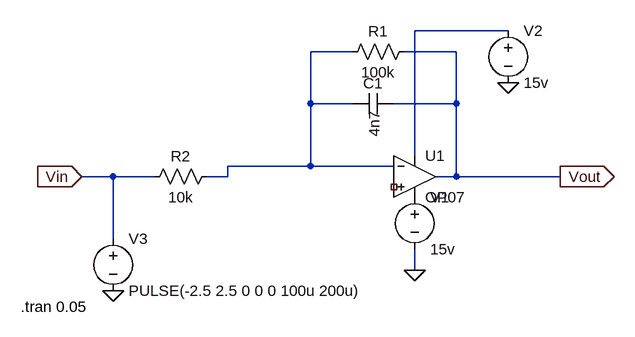
[diagram p0: schematic (7) integrator using op-amp.asc]
(7) integrator using op-amp.asc, the LTspice schematic file:
Version 4
SHEET 1 880 680
WIRE 352 48 208 48
WIRE 112 80 48 80
WIRE 272 80 192 80
WIRE 48 160 48 80
WIRE 112 160 48 160
WIRE 272 160 272 80
WIRE 272 160 176 160
WIRE 208 240 208 48
WIRE 48 256 48 160
WIRE 48 256 -80 256
WIRE 176 256 48 256
WIRE -256 272 -304 272
WIRE -192 272 -256 272
WIRE -80 272 -80 256
WIRE -80 272 -112 272
WIRE 272 272 272 160
WIRE 272 272 240 272
WIRE 432 272 272 272
WIRE -256 368 -256 272
WIRE 208 416 208 384
FLAG -304 272 Vin
IOPIN -304 272 In
FLAG 432 272 Vout
IOPIN 432 272 Out
FLAG 208 416 0
FLAG 352 128 0
FLAG -256 448 0
SYMBOL res 208 64 R90
WINDOW 0 0 56 VBottom 2
WINDOW 3 32 56 VTop 2
SYMATTR InstName R1
SYMATTR Value 100k
SYMBOL res -96 256 R90
WINDOW 0 0 56 VBottom 2
WINDOW 3 32 56 VTop 2
SYMATTR InstName R2
SYMATTR Value 10k
SYMBOL cap 176 144 R90
WINDOW 0 0 32 VBottom 2
WINDOW 3 47 46 Bottom 2
SYMATTR InstName C1
SYMATTR Value 4n7
SYMBOL voltage 208 288 R0
WINDOW 123 0 0 Left 0
WINDOW 39 0 0 Left 0
SYMATTR InstName V1
SYMATTR Value 15v
SYMBOL voltage 352 32 R0
WINDOW 123 0 0 Left 0
WINDOW 39 0 0 Left 0
SYMATTR InstName V2
SYMATTR Value 15v
SYMBOL voltage -256 352 R0
WINDOW 123 0 0 Left 0
WINDOW 39 0 0 Left 0
SYMATTR InstName V3
SYMATTR Value PULSE(-2.5 2.5 0 0 0 100u 200u)
SYMBOL OpAmps\\OP07 208 208 R0
SYMATTR InstName U1
TEXT -398 472 Left 2 !.tran 0.05

The netlist it stands for:
* (7) integrator using op-amp.asc
R1 Vout N002 100k
R2 N002 Vin 10k
C1 Vout N002 4n7
V1 P001 0 15v
V2 N001 0 15v
V3 Vin 0 PULSE(-2.5 2.5 0 0 0 100u 200u)
XU1 NC_01 N002 N001 P001 Vout LT1001  ; OP07, pins In+ In- V+ V- OUT
.tran 0.05
.lib LTC.lib
.backanno
.end